# Altium project Pedal_FootSW.PrjPcb
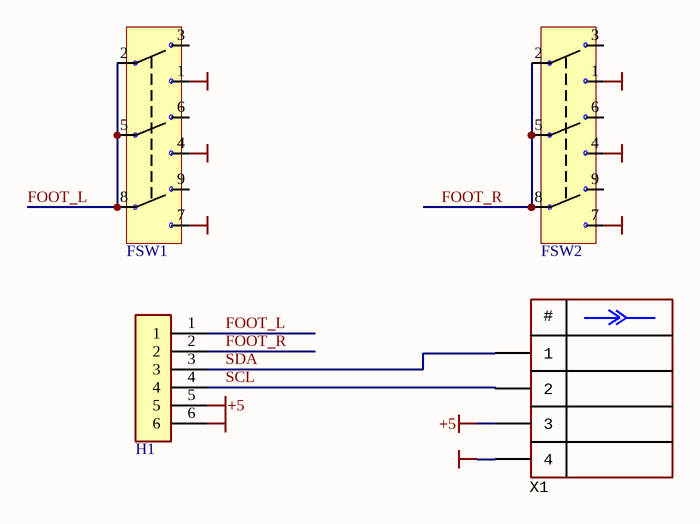
[diagram p0: FootSW.SchDoc]
1 sheet, 4 parts. Net scope: global (net labels, ports and power ports of the same name join across sheets).
Board file: FootSW.PcbDoc

## Sheet FootSW.SchDoc
size A4; SheetNumber: 1; SheetTotal: 1

### Parts
FSW1  FootSwitch  [FOOTSW]  (value not drawn)
FSW2  FootSwitch  [FOOTSW]  (value not drawn)
H1  1.5-6A  [1.5-6A]  (value not drawn)
X1  (no value)  [CON: PBS-4]

### Nets
+5: H1.5 X1.3
GND: FSW1.1 FSW1.4 FSW1.7 FSW2.1 FSW2.4 FSW2.7 H1.6 X1.4
FOOT_L: FSW1.2 FSW1.5 FSW1.8 H1.1
FOOT_R: FSW2.2 FSW2.5 FSW2.8 H1.2
SC~{L}: H1.4 X1.2
SDA: H1.3 X1.1

Not connected (* = marked no-connect by the designer): FSW1 3 6 9; FSW2 3 6 9

### Notes on the sheet
- (in symbol PBS-4) #

### Library data of the parts
H1 = 1.5-6A: Pin Header p=1.5mm, 6 pins
X1 = PBS-4: Manufacturer: Connfly; ValueManufacturerPartNumber: Connector, 4pin, 2.54mm, 500VAC, 3A; TypeConnector: Connector; VoltageMax: 500VAC; Pitch: 2.54mm; CurrentMax: 3A; Multichannel: 4pin; CommentText: "Разъем"; HelpURL: https://www.chipdip.ru/product/pbs-4; PartNumber: PBS-4